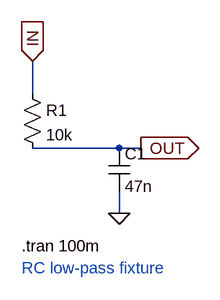
[diagram p0: schematic simple-rc.asc]
simple-rc.asc, the LTspice schematic file:
Version 4
SHEET 1 880 680
WIRE 16 -32 16 16
WIRE 16 96 144 96
WIRE 144 96 176 96
WIRE 144 160 144 192
FLAG 16 -32 IN
IOPIN 16 -32 In
FLAG 176 96 OUT
IOPIN 176 96 Out
FLAG 144 192 0
SYMBOL res 0 0 R0
SYMATTR InstName R1
SYMATTR Value 10k
SYMBOL cap 128 96 R0
SYMATTR InstName C1
SYMATTR Value 47n
TEXT 0 240 Left 2 !.tran 100m
TEXT 0 272 Left 2 ;RC low-pass fixture

The netlist it stands for:
* simple-rc.asc
R1 IN OUT 10k
C1 OUT 0 47n
.tran 100m
* RC low-pass fixture
.backanno
.end